# Altium schematic sheet Sheet2.SchDoc
size 420 x 297 mm
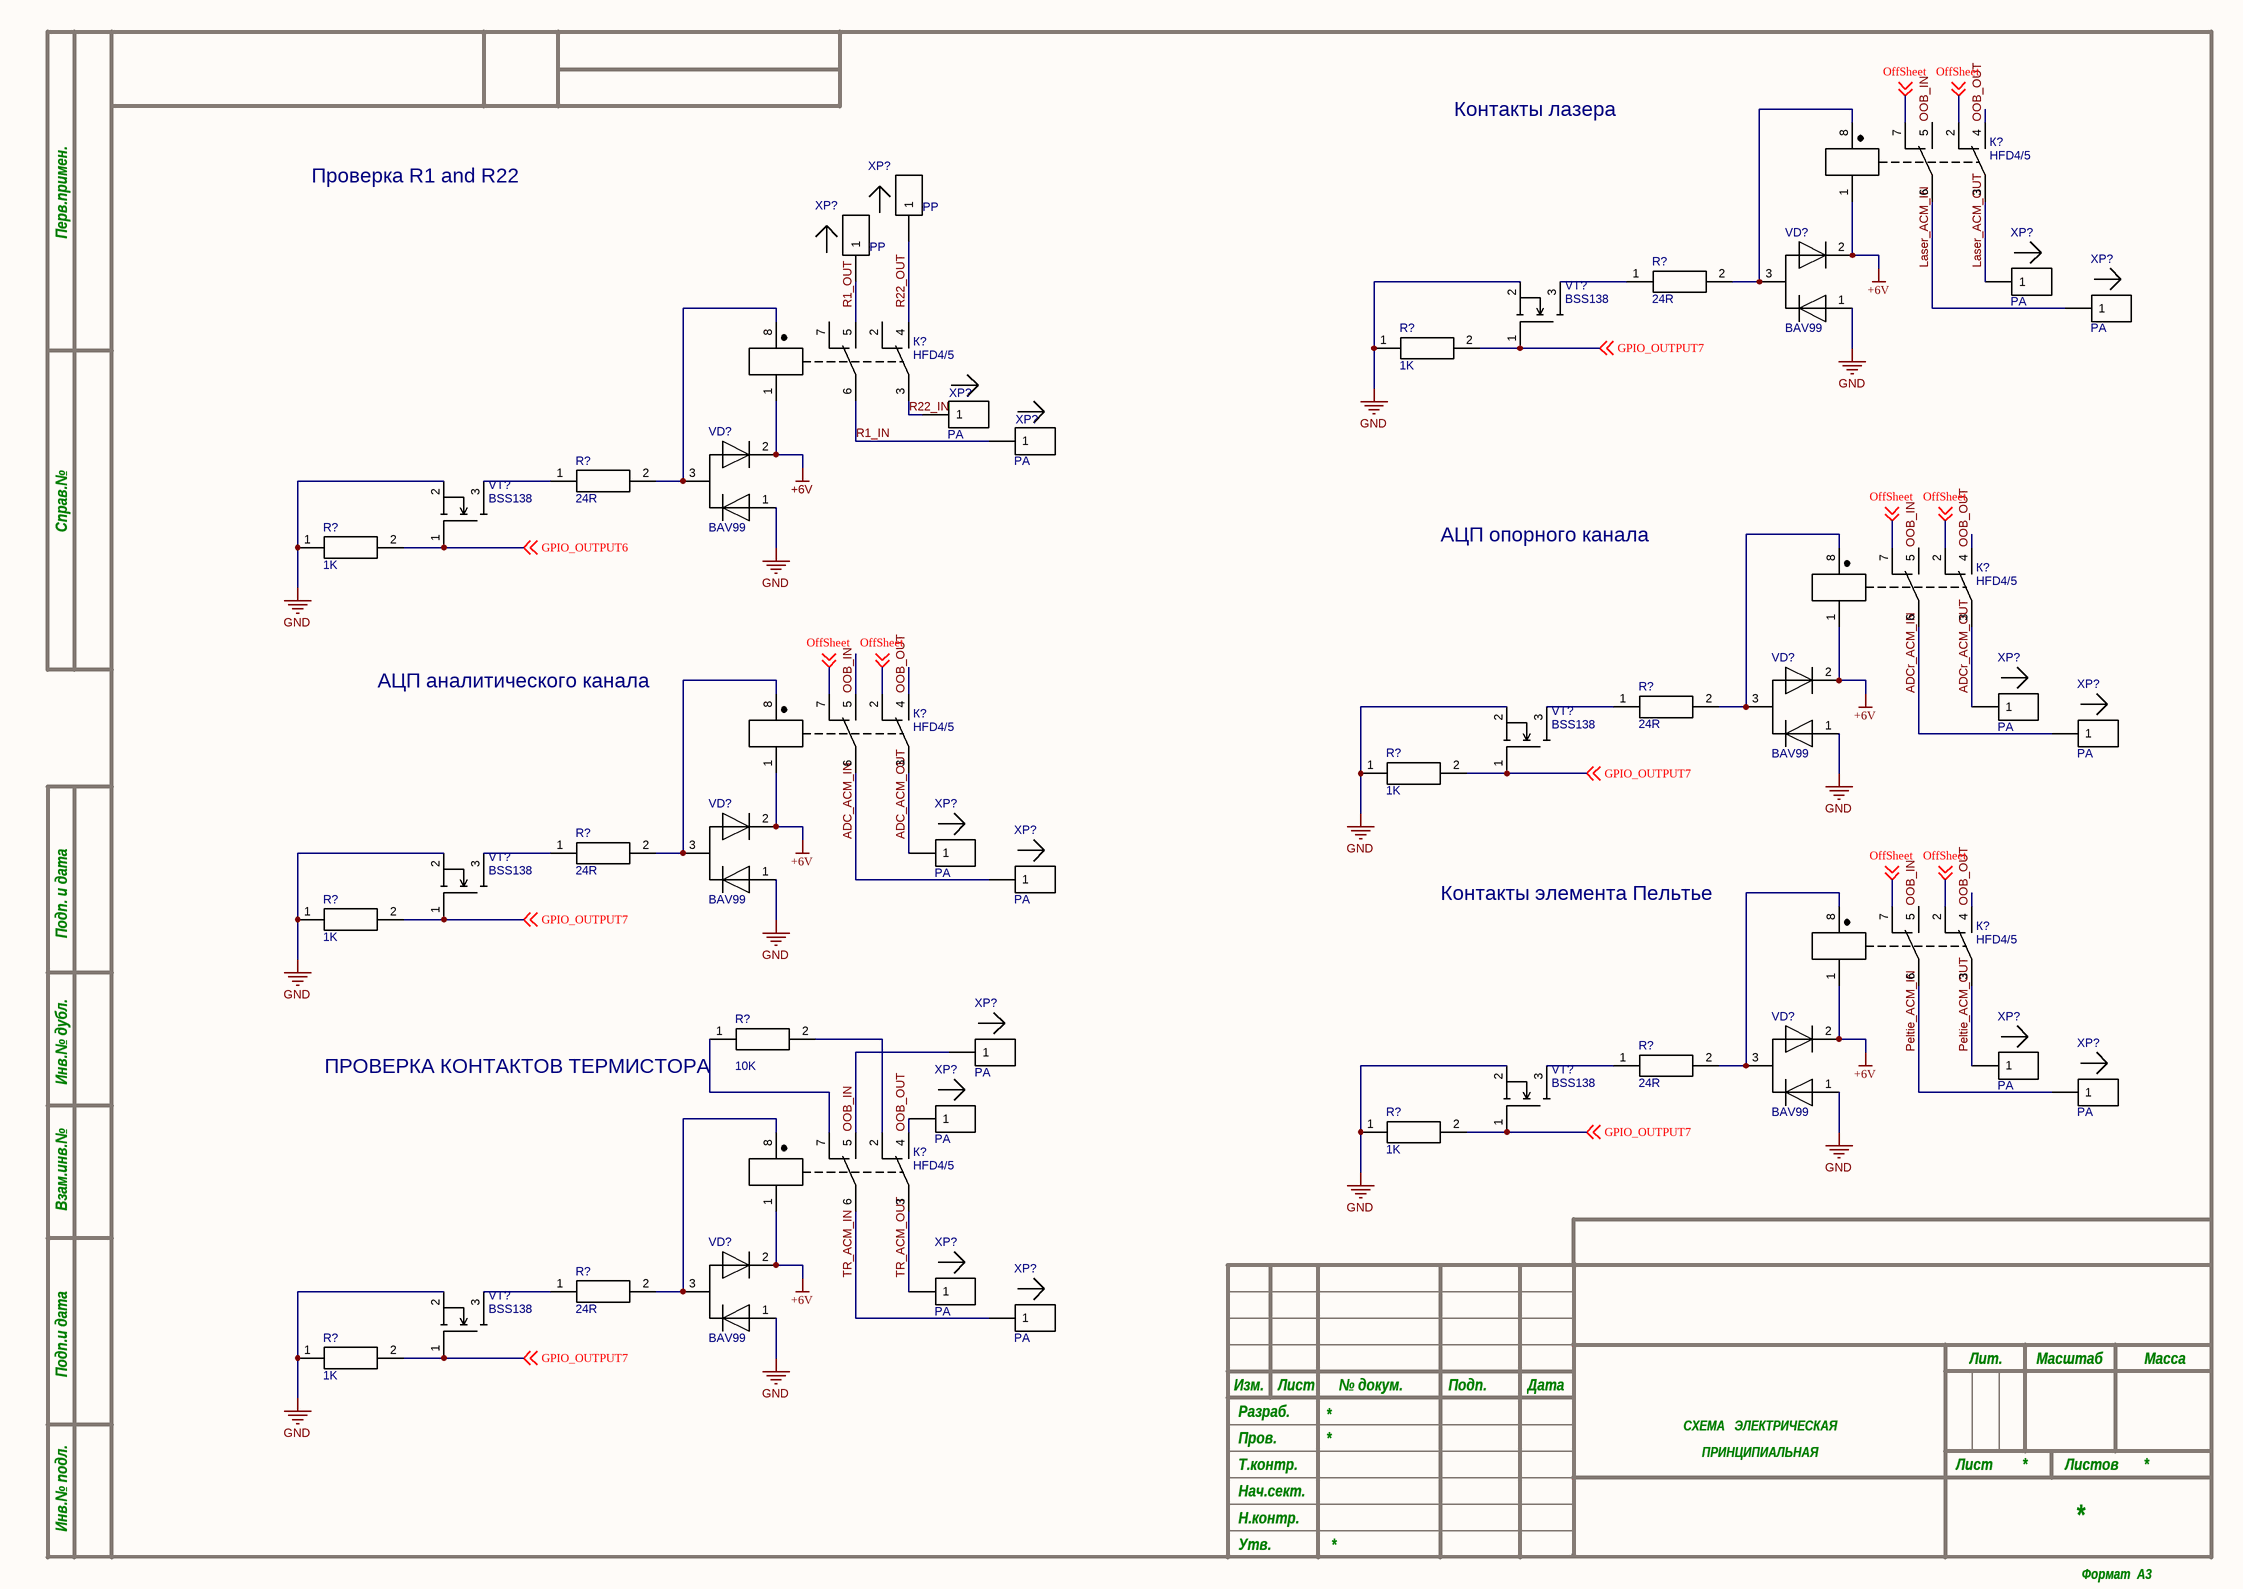
[diagram p0: Sheet2.SchDoc]

## Parts
(Parts that share a designator on the sheet are numbered #1, #2 ... from top to bottom, then left to right.)
R?#1  24R  [R0402]
R?#2  1K  [R0402]
R?#3  24R  [R0402]
R?#4  1K  [R0402]
R?#5  24R  [R0402]
R?#6  1K  [R0402]
R?#7  24R  [R0402]
R?#8  1K  [R0402]
R?#9  10K  [R0402]
R?#10  24R  [R0402]
R?#11  1K  [R0402]
R?#12  24R  [R0402]
R?#13  1K  [R0402]
VD?#1  BAV99  [SOT-23-3]
VD?#2  BAV99  [SOT-23-3]
VD?#3  BAV99  [SOT-23-3]
VD?#4  BAV99  [SOT-23-3]
VD?#5  BAV99  [SOT-23-3]
VD?#6  BAV99  [SOT-23-3]
VT?#1  BSS138  [SOT-23-3]
VT?#2  BSS138  [SOT-23-3]
VT?#3  BSS138  [SOT-23-3]
VT?#4  BSS138  [SOT-23-3]
VT?#5  BSS138  [SOT-23-3]
VT?#6  BSS138  [SOT-23-3]
XP?#1  PP  [pogo pin]
XP?#2  PP  [pogo pin]
XP?#3  PA  [pogo pin]
XP?#4  PA  [pogo pin]
XP?#5  PA  [pogo pin]
XP?#6  PA  [pogo pin]
XP?#7  PA  [pogo pin]
XP?#8  PA  [pogo pin]
XP?#9  PA  [pogo pin]
XP?#10  PA  [pogo pin]
XP?#11  PA  [pogo pin]
XP?#12  PA  [pogo pin]
XP?#13  PA  [pogo pin]
XP?#14  PA  [pogo pin]
XP?#15  PA  [pogo pin]
XP?#16  PA  [pogo pin]
К?#1  HFD4/5  [DIP-8]
К?#2  HFD4/5  [DIP-8]
К?#3  HFD4/5  [DIP-8]
К?#4  HFD4/5  [DIP-8]
К?#5  HFD4/5  [DIP-8]
К?#6  HFD4/5  [DIP-8]

## Nets
+6V: VD?#1.2 VD?#2.2 VD?#3.2 VD?#4.2 VD?#5.2 VD?#6.2 К?#1.1 К?#2.1 К?#3.1 К?#4.1 К?#5.1 К?#6.1
GND: R?#2.1 R?#4.1 R?#6.1 R?#8.1 R?#11.1 R?#13.1 VD?#1.1 VD?#2.1 VD?#3.1 VD?#4.1 VD?#5.1 VD?#6.1 VT?#1.2 VT?#2.2 VT?#3.2 VT?#4.2 VT?#5.2 VT?#6.2
ADC_ACM_IN: XP?#10.1 К?#4.6
ADC_ACM_OUT: XP?#9.1 К?#4.3
ADCr_ACM_IN: XP?#8.1 К?#3.6
ADCr_ACM_OUT: XP?#7.1 К?#3.3
GPIO_OUTPUT6: R?#4.2 VT?#2.1 ; off-sheet GPIO_OUTPUT6
GPIO_OUTPUT7: R?#2.2 R?#6.2 R?#8.2 R?#11.2 R?#13.2 VT?#1.1 VT?#3.1 VT?#4.1 VT?#5.1 VT?#6.1 ; off-sheet GPIO_OUTPUT7
Laser_ACM_IN: XP?#4.1 К?#1.6
Laser_ACM_OUT: XP?#3.1 К?#1.3
OffSheet: К?#1.2 К?#1.7 К?#3.2 К?#3.7 К?#4.2 К?#4.7 К?#5.2 К?#5.7 ; off-sheet OffSheet
OOB_IN: XP?#11.1 К?#1.5 К?#3.5 К?#4.5 К?#5.5 К?#6.5
OOB_OUT: XP?#14.1 К?#1.4 К?#3.4 К?#4.4 К?#5.4 К?#6.4
Peltie_ACM_IN: XP?#13.1 К?#5.6
Peltie_ACM_OUT: XP?#12.1 К?#5.3
R1_IN: XP?#6.1 К?#2.6
R1_OUT: XP?#2.1 К?#2.5
R22_IN: XP?#5.1 К?#2.3
R22_OUT: XP?#1.1 К?#2.4
TR_ACM_IN: XP?#16.1 К?#6.6
TR_ACM_OUT: XP?#15.1 К?#6.3
NetR?#1_1: R?#1.1 VT?#1.3
NetR?#1_2: R?#1.2 VD?#1.3 К?#1.8
NetR?#3_1: R?#3.1 VT?#2.3
NetR?#3_2: R?#3.2 VD?#2.3 К?#2.8
NetR?#5_1: R?#5.1 VT?#3.3
NetR?#5_2: R?#5.2 VD?#3.3 К?#3.8
NetR?#7_1: R?#7.1 VT?#4.3
NetR?#7_2: R?#7.2 VD?#4.3 К?#4.8
NetR?#9_1: R?#9.1 К?#6.7
NetR?#9_2: R?#9.2 К?#6.2
NetR?#10_1: R?#10.1 VT?#5.3
NetR?#10_2: R?#10.2 VD?#5.3 К?#5.8
NetR?#12_1: R?#12.1 VT?#6.3
NetR?#12_2: R?#12.2 VD?#6.3 К?#6.8

Not connected (* = marked no-connect by the designer): К?#2 2 7

## Notes on the sheet
- Контакты лазера
- Проверка R1 and R22
- АЦП опорного канала
- АЦП аналитического канала
- Контакты элемента Пельтье
- ПРОВЕРКА КОНТАКТОВ ТЕРМИСТОРА
- Перв.примен.
- Справ.№
- Подп. и дата
- Инв.№ дубл.
- Взам.инв.№
- Подп.и дата
- Разраб.
- Изм.
- Лист
- № докум.
- Подп.
- Дата
- Лит.
- Масштаб
- Масса
- Т.контр.
- Пров.
- СХЕМА   ЭЛЕКТРИЧЕСКАЯ
- ПРИНЦИПИАЛЬНАЯ
- Листов
- Инв.№ подл.
- Утв.
- Н.контр.
- Нач.сект.
- Формат  A3

## Library data of the parts
R?#1 R?#3 R?#5 R?#7 R?#10 R?#12 = R0402-24R: Resistor SMD 24R 1% 0402; Part Number: SMD RES 24R OHM 1% ±100ppm/°C 0402; Added_by: Rutel@teslatec.ru; Solder_Amount: 2; Pkg: 0402; Created_at: 21/04/2020; MountType: SMD; Mount: MOUNT
R?#2 R?#4 R?#6 R?#8 R?#11 R?#13 = R0402-1K: Resistor SMD 1K 1% 0402; Part Number: SMD RES 1 KOHM 1% ±100ppm/°C 0402; Added_by: irdolgopolowa@yandex.ru; Solder_Amount: 2; Pkg: 0402; Created_at: 29/10/24; MountType: SMD; Mount: MOUNT
R?#9 = R0402-10K: Resistor SMD 10K 1% 0402; Part Number: SMD RES 10 KOHM 1% ±100ppm/°C 0402; Added_by: Rutel@teslatec.ru; Solder_Amount: 2; Pkg: 0402; Created_at: 21/04/2020; MountType: SMD; Mount: MOUNT
VD?#1-VD?#6 = BAV99: BAV99, UMW, 70В, 200мА; Added_by: andrew@teslatec.ru; Solder_Amount: 3; Created_at: 29/06/2020; Mount: MOUNT; MountType: SMD; Pkg: SOT-23-3; Part Number: BAV99
VT?#1-VT?#6 = BSS138: N-Channel Logic Level Enhancement Mode Field Effect Transistor; Solder_Amount: 3; Added_by: ma_lubushkin@teslatec.ru; Pkg: SOT-23; Part Number: BSS138; Mount: MOUNT; MountType: SMD; Created_at: 03/12/2019
XP?#1-XP?#16 = P100-A2 / P100-A: Pogo pin, 33.35x1.36; Added_by: irdolgopolowa@yandex.ru; Created_at: 29/10/24; Mount: MOUNT; MountType: THM; Part Number: P100-A2 / P100-A; Pkg: *
К?#1-К?#6 = HFD4/5: HFD4/5 (IM03TS) (1-1462037-8), 5VDC, 2A/250VAC DPDT; Part Number: HFD4/5SR; Added_by: irdolgopolowa@yandex.ru; Solder_Amount: 8; Created_at: 30/10/24; Mount: MOUNT; MountType: THM; Pkg: DIP-8